# Altium project MB1814.PrjPcb (part 1 of 2)
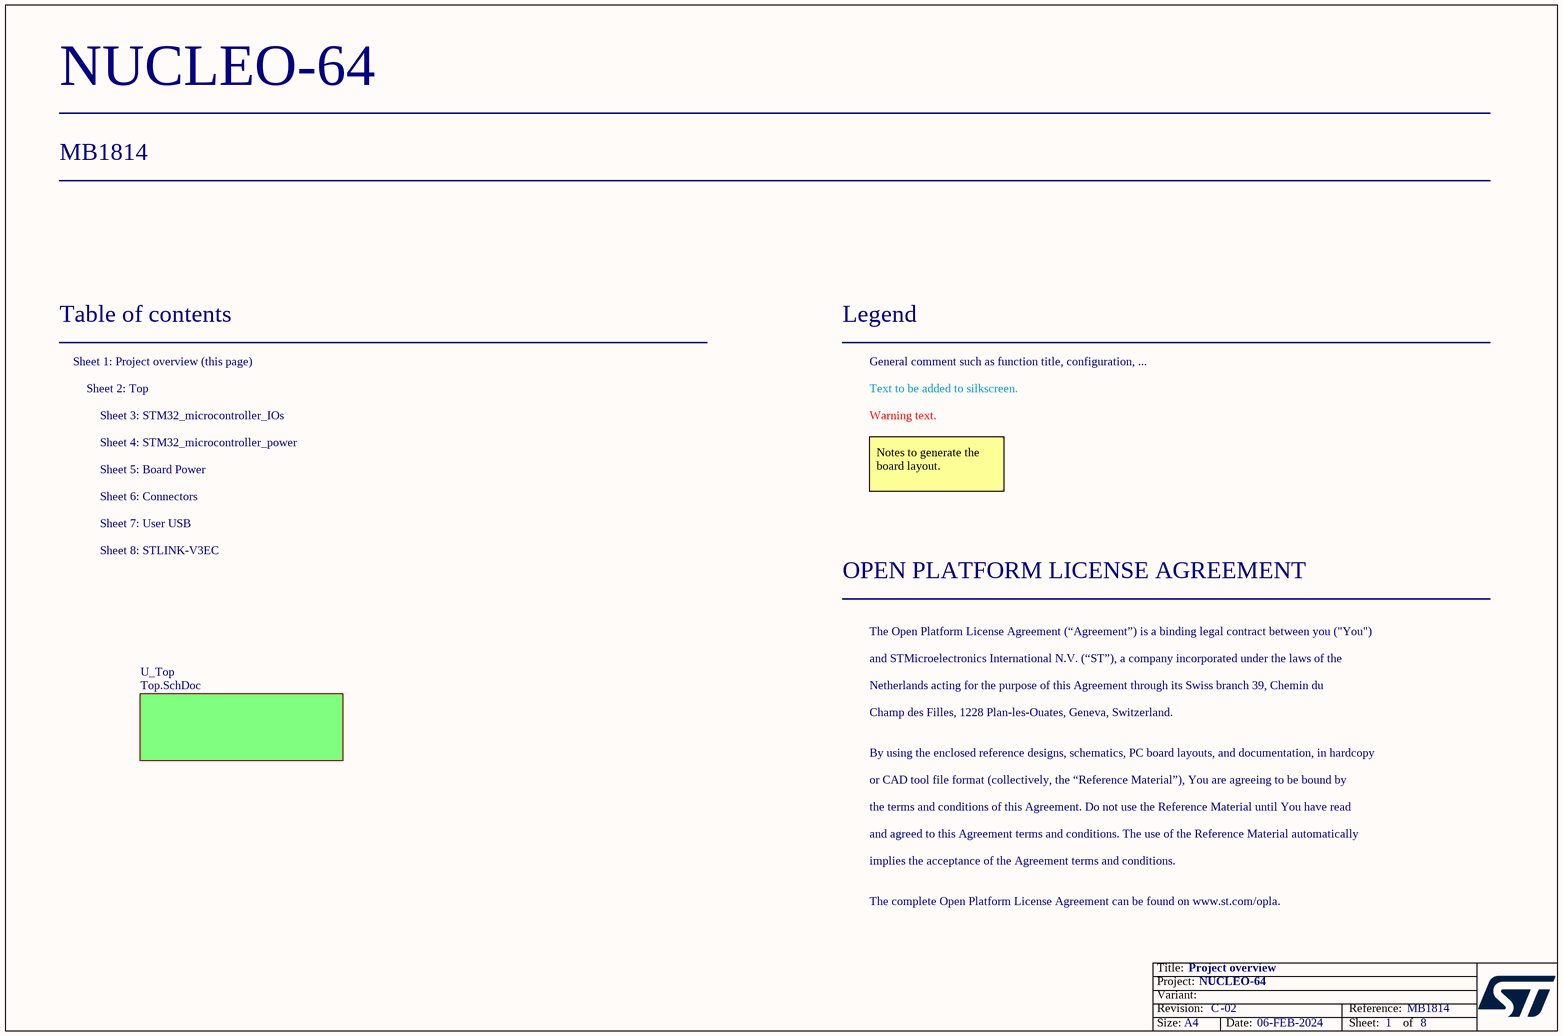
[diagram p0: Project_overview.SchDoc]
Board_Assembly_Revision: 02; Board_Document_Date: 06-FEB-2024; Board_Name: NUCLEO-64; Board_PCB_Revision: C; Board_Reference: MB1814
8 sheets, 206 parts. Net scope: flat (ports and power ports of the same name join across sheets).
Board file: MB1814.PcbDoc
Sheets:
  Project_overview.SchDoc
    U_Top = Top.SchDoc
      U_STM32_microcontroller_IOs = STM32_microcontroller_IOs.SchDoc
      U_STM32_microcontroller_power = STM32_microcontroller_power.SchDoc
      U_Board_Power = Board_Power.SchDoc
      U_User_USB = User_USB.SchDoc
      U_Connectors = Connectors.SchDoc
      U_STLINK_V3EC = STLINK_V3EC.SchDoc

## Sheet Project_overview.SchDoc: Project overview
size A4; Date: Not used; ApprovedBy: Not used; CheckedBy: Not used; Author: Not used; CompanyName: STMicroelectronics; DrawnBy: Not used; Engineer: Not used; Organization: Not used; Address1: Not used; Address2: Not used; Address3: Not used; Address4: Not used; DocumentNumber: 1; Revision: Not used; SheetNumber: 1; SheetTotal: 8; CurrentTime: Not used; CurrentDate: Not used; Time: Not used; DocumentFullPathAndName: Not used; DocumentName: Not used; ModifiedDate: Not used; ImagePath: Not used; ProjectName: Not used; Application_BuildNumber: Not used

### Sub-sheets
U_Top = Top.SchDoc: no entries

### Notes on the sheet
- Table of contents
- Sheet 1: Project overview (this page)
- Legend
- General comment such as function title, configuration, ...
- Sheet 2: Top
- Sheet 4: STM32_microcontroller_power
- Sheet 3: STM32_microcontroller_IOs
- Text to be added to silkscreen.
- Warning text.
- Sheet 5: Board Power
- Sheet 6: Connectors
- Notes to generate the board layout.
- Sheet 8: STLINK-V3EC
- Sheet 7: User USB
- OPEN PLATFORM LICENSE AGREEMENT
- The Open Platform License Agreement (“Agreement”) is a binding legal contract between you ("You")
- and STMicroelectronics International N.V. (“ST”), a company incorporated under the laws of the
- Netherlands acting for the purpose of this Agreement through its Swiss branch 39, Chemin du
- Champ des Filles, 1228 Plan-les-Ouates, Geneva, Switzerland.
- By using the enclosed reference designs, schematics, PC board layouts, and documentation, in hardcopy
- or CAD tool file format (collectively, the “Reference Material”), You are agreeing to be bound by
- the terms and conditions of this Agreement. Do not use the Reference Material until You have read
- and agreed to this Agreement terms and conditions. The use of the Reference Material automatically
- implies the acceptance of the Agreement terms and conditions.
- The complete Open Platform License Agreement can be found on www.st.com/opla.
- Title:
- Project:
- Size:
- Revision:
- Variant:
- A4
- -
- Date:
- Reference:
- Sheet:
- of

## Sheet Top.SchDoc: Top
size A4; Date: Not used; ApprovedBy: Not used; CheckedBy: Not used; Author: Not used; CompanyName: STMicroelectronics; DrawnBy: Not used; Engineer: Not used; Organization: Not used; Address1: Not used; Address2: Not used; Address3: Not used; Address4: Not used; DocumentNumber: 2; Revision: A-01-P3; SheetNumber: 2; SheetTotal: 8; CurrentTime: Not used; CurrentDate: Not used; Time: Not used; DocumentFullPathAndName: Not used; DocumentName: Not used; ModifiedDate: Not used; ImagePath: Not used; ProjectName: Not used; Application_BuildNumber: Not used
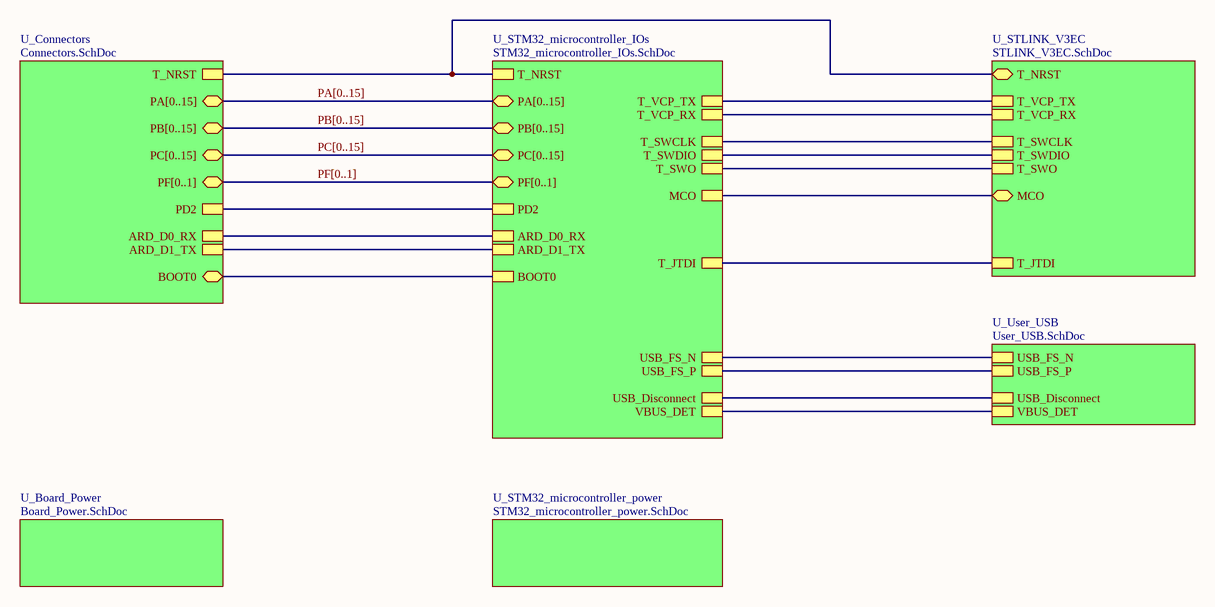
[diagram p1: Top.SchDoc]

### Sub-sheets
U_Board_Power = Board_Power.SchDoc: no entries
U_Connectors = Connectors.SchDoc: PA[0..15] (bidir), PB[0..15] (bidir), PC[0..15] (bidir), PD2, T_NRST, PF[0..1] (bidir), ARD_D0_RX, ARD_D1_TX, BOOT0 (bidir)
U_STLINK_V3EC = STLINK_V3EC.SchDoc: T_NRST (bidir), MCO (bidir), T_VCP_RX, T_VCP_TX, T_JTDI, T_SWCLK, T_SWO, T_SWDIO
U_STM32_microcontroller_IOs = STM32_microcontroller_IOs.SchDoc: PA[0..15] (bidir), PB[0..15] (bidir), PC[0..15] (bidir), PF[0..1] (bidir), ARD_D0_RX, ARD_D1_TX, MCO, PD2, T_NRST, T_VCP_TX, T_VCP_RX, T_SWCLK, T_SWO, T_SWDIO, T_JTDI, USB_FS_N, USB_FS_P, BOOT0, USB_Disconnect, VBUS_DET
U_STM32_microcontroller_power = STM32_microcontroller_power.SchDoc: no entries
U_User_USB = User_USB.SchDoc: VBUS_DET, USB_FS_N, USB_FS_P, USB_Disconnect

### Nets
(unnamed): sheet U_STM32_microcontroller_IOs/ARD_D0_RX, sheet U_Connectors/ARD_D0_RX
(unnamed): sheet U_STM32_microcontroller_IOs/ARD_D1_TX, sheet U_Connectors/ARD_D1_TX
(unnamed): sheet U_STM32_microcontroller_IOs/MCO, sheet U_STLINK_V3EC/MCO
(unnamed): sheet U_STM32_microcontroller_IOs/PD2, sheet U_Connectors/PD2
(unnamed): sheet U_STM32_microcontroller_IOs/T_NRST, sheet U_Connectors/T_NRST, sheet U_STLINK_V3EC/T_NRST
(unnamed): sheet U_STM32_microcontroller_IOs/T_VCP_TX, sheet U_STLINK_V3EC/T_VCP_TX
(unnamed): sheet U_STM32_microcontroller_IOs/T_VCP_RX, sheet U_STLINK_V3EC/T_VCP_RX
(unnamed): sheet U_STM32_microcontroller_IOs/T_SWCLK, sheet U_STLINK_V3EC/T_SWCLK
(unnamed): sheet U_STM32_microcontroller_IOs/T_SWO, sheet U_STLINK_V3EC/T_SWO
(unnamed): sheet U_STM32_microcontroller_IOs/T_SWDIO, sheet U_STLINK_V3EC/T_SWDIO
(unnamed): sheet U_STM32_microcontroller_IOs/T_JTDI, sheet U_STLINK_V3EC/T_JTDI
(unnamed): sheet U_STM32_microcontroller_IOs/USB_FS_N, sheet U_User_USB/USB_FS_N
(unnamed): sheet U_STM32_microcontroller_IOs/USB_FS_P, sheet U_User_USB/USB_FS_P
(unnamed): sheet U_STM32_microcontroller_IOs/BOOT0, sheet U_Connectors/BOOT0
(unnamed): sheet U_STM32_microcontroller_IOs/USB_Disconnect, sheet U_User_USB/USB_Disconnect
(unnamed): sheet U_STM32_microcontroller_IOs/VBUS_DET, sheet U_User_USB/VBUS_DET

### Buses and harness runs
bus PA[0..15] = sheet U_Connectors/PA[0..15] = sheet U_STM32_microcontroller_IOs/PA[0..15]
bus PB[0..15] = sheet U_Connectors/PB[0..15] = sheet U_STM32_microcontroller_IOs/PB[0..15]
bus PC[0..15] = sheet U_Connectors/PC[0..15] = sheet U_STM32_microcontroller_IOs/PC[0..15]
bus PF[0..1] = sheet U_Connectors/PF[0..1] = sheet U_STM32_microcontroller_IOs/PF[0..1]

### Notes on the sheet
- Title:
- Project:
- Size:
- Revision:
- Variant:
- A4
- -
- Date:
- Reference:
- Sheet:
- of

## Sheet STM32_microcontroller_IOs.SchDoc: STM32_microcontroller_I/Os
size A4; Date: Not used; ApprovedBy: Not used; CheckedBy: Not used; Author: Not used; CompanyName: STMicroelectronics; DrawnBy: Not used; Engineer: Not used; Organization: Not used; Address1: Not used; Address2: Not used; Address3: Not used; Address4: Not used; DocumentNumber: 3; Revision: Not used; SheetNumber: 3; SheetTotal: 8; CurrentTime: Not used; CurrentDate: Not used; Time: Not used; DocumentFullPathAndName: Not used; DocumentName: Not used; ModifiedDate: Not used; ImagePath: Not used; ProjectName: Not used; Application_BuildNumber: Not used
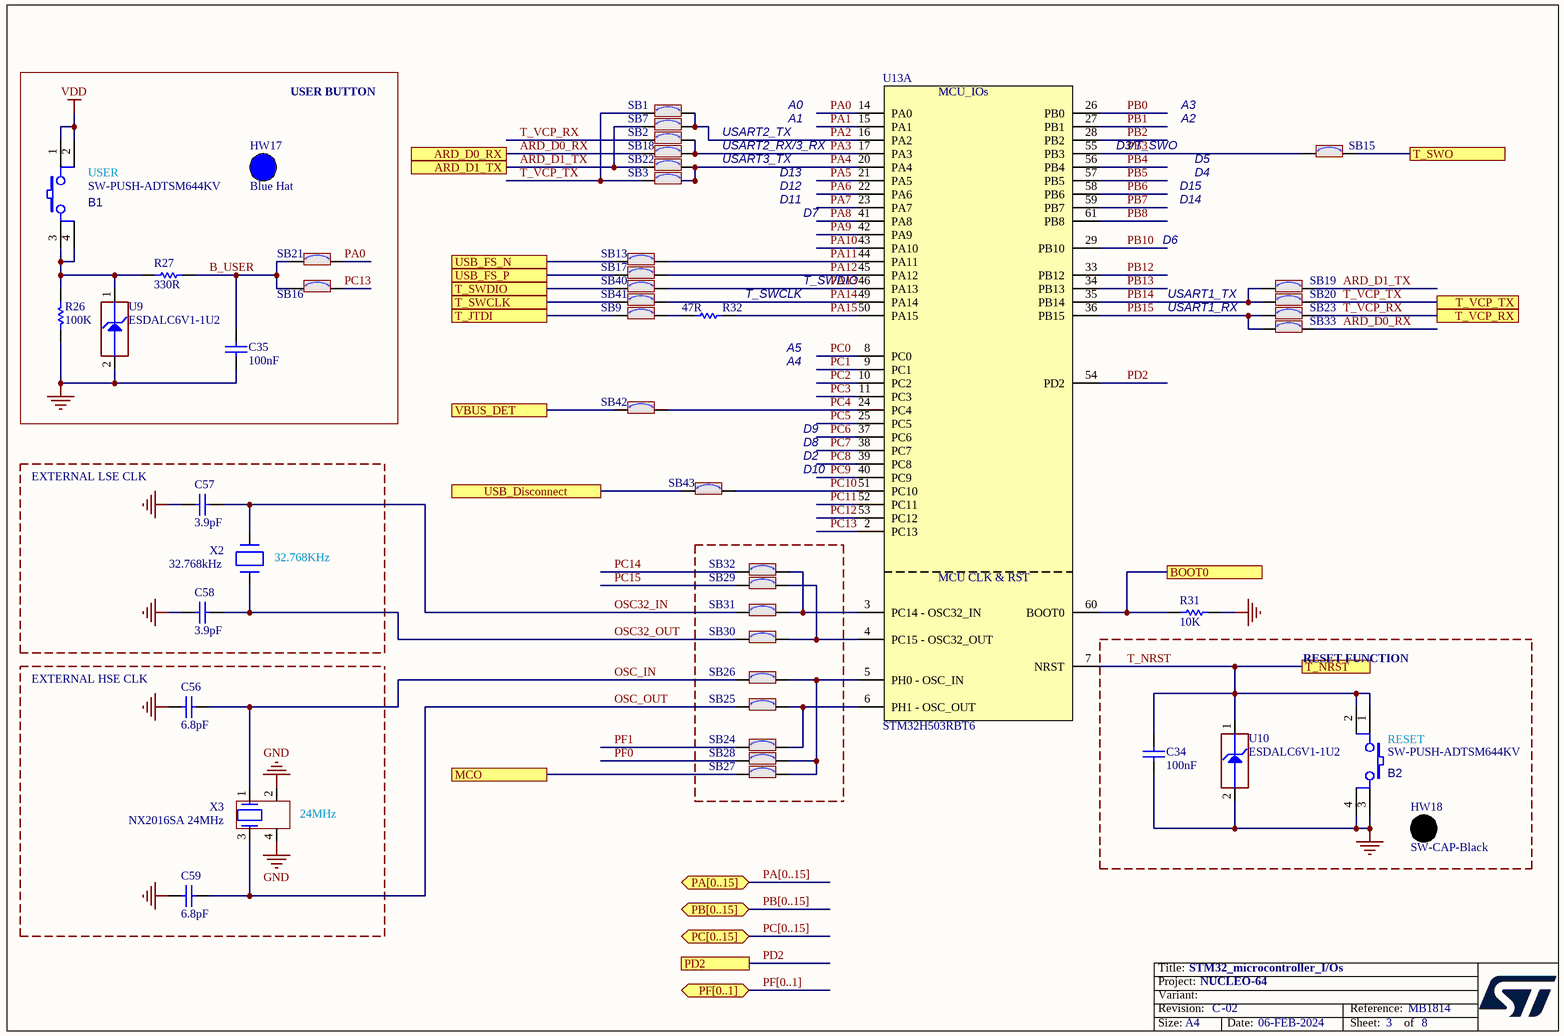
[diagram p2: STM32_microcontroller_IOs.SchDoc]

### Parts
B1  value SW-PUSH-ADTSM644KV  [SWI_APEM_ADTSM644KV_BLACK]  (hidden comment: SW_PUSH_SMD)
B2  value SW-PUSH-ADTSM644KV  [SWI_APEM_ADTSM644KV_BLACK]  (hidden comment: SW_PUSH_SMD)
C34  value 100nF  [C0402]  (hidden comment: Capacitor)
C35  value 100nF  [C0402]  (hidden comment: Capacitor)
C56  value 6.8pF  [C0402]
C57  value 3.9pF  [C0402]  (hidden comment: Capacitor)
C58  value 3.9pF  [C0402]  (hidden comment: Capacitor)
C59  value 6.8pF  [C0402]
HW17  value Blue Hat  (hidden comment: BUTTON_HAT_BLUE)  (mechanical)
HW18  SW-CAP-Black  [N/A]  (mechanical)
R26  value 100K  [R0603]
R27  value 330R  [R0603]
R31  value 10K  [R0603]
R32  value 47R  [R0402]
SB1  (no value)  [SOLDER-BRIDGE_R0603-0R]
SB2  (no value)  [SOLDER-BRIDGE_R0603-0R]
SB3  (no value)  [SOLDER-BRIDGE_R0603-0R]
SB7  (no value)  [SOLDER-BRIDGE_R0603-0R]
SB9  (no value)  [SOLDER-BRIDGE_R0603-0R]
SB13  (no value)  [SOLDER-BRIDGE_R0603-0R]
SB15  (no value)  [SOLDER-BRIDGE_R0603-0R]
SB16  (no value)  [SOLDER-BRIDGE_R0603-0R]
SB17  (no value)  [SOLDER-BRIDGE_R0603-0R]
SB18  (no value)  [SOLDER-BRIDGE_R0603-0R]
SB19  (no value)  [SOLDER-BRIDGE_R0603-0R]
SB20  (no value)  [SOLDER-BRIDGE_R0603-0R]
SB21  (no value)  [SOLDER-BRIDGE_R0603-0R]
SB22  (no value)  [SOLDER-BRIDGE_R0603-0R]
SB23  (no value)  [SOLDER-BRIDGE_R0603-0R]
SB24  (no value)  [SOLDER-BRIDGE_R0603-0R]
SB25  (no value)  [SOLDER-BRIDGE_R0603-0R]
SB26  (no value)  [SOLDER-BRIDGE_R0603-0R]
SB27  (no value)  [SOLDER-BRIDGE_R0603-0R]
SB28  (no value)  [SOLDER-BRIDGE_R0603-0R]
SB29  (no value)  [SOLDER-BRIDGE_R0603-0R]
SB30  (no value)  [SOLDER-BRIDGE_R0603-0R]
SB31  (no value)  [SOLDER-BRIDGE_R0603-0R]
SB32  (no value)  [SOLDER-BRIDGE_R0603-0R]
SB33  (no value)  [SOLDER-BRIDGE_R0603-0R]
SB40  (no value)  [SOLDER-BRIDGE_R0603-0R]
SB41  (no value)  [SOLDER-BRIDGE_R0603-0R]
SB42  (no value)  [SOLDER-BRIDGE_R0603-0R]
SB43  (no value)  [SOLDER-BRIDGE_R0603-0R]
U9  value ESDALC6V1-1U2  [ESD_ST0201]
U10  value ESDALC6V1-1U2  [ESD_ST0201]
U13  value STM32H503RBT6  [ICC_LQFP64_10X10_P050_SOCKET_YAMAICHI_IC149-064-069-B5_NM]  (hidden comment: STM32H503RBH6)  (part A of 2)
X2  value 32.768kHz  [CRY_NX1610SE_2P]  (hidden comment: XTAL_2_PINS)
X3  value NX2016SA 24MHz  [CRY_NX2016SA_4P]

### Ports
ARD_D0_RX, ARD_D1_TX, BOOT0, MCO, PA[0..15] (bidir), PB[0..15] (bidir), PC[0..15] (bidir), PD2, PF[0..1] (bidir), T_JTDI, T_NRST, T_SWCLK, T_SWDIO, T_SWO, T_VCP_RX, T_VCP_TX, USB_Disconnect, USB_FS_N, USB_FS_P, VBUS_DET

### Nets
GND: B2.3 B2.4 C34.1 C35.1 C56.1 C57.1 C58.1 C59.1 R26.1 R31.1 U9.2(GND) U10.2(GND) X3.2 X3.4
VDD: B1.1 B1.2
ARD_D0_RX: SB18.2 SB33.1 ; port ARD_D0_RX
ARD_D1_TX: SB7.2 SB19.1 SB22.2 ; port ARD_D1_TX
B_USER: C35.2 R27.2 SB16.1 SB21.1
BOOT0: R31.2 U13.60(BOOT0) ; port BOOT0
MCO: SB27.1 ; port MCO
OSC32_IN: C57.2 SB31.1 X2.2(X2)
OSC32_OUT: C58.2 SB30.1 X2.1(X1)
OSC_IN: C56.2 SB26.1 X3.1
OSC_OUT: C59.2 SB25.1 X3.3
PA0: SB21.2 U13.14(PA0)
PA1: U13.15(PA1)
PA2: SB1.1 SB7.1 U13.16(PA2)
PA3: SB2.1 SB18.1 U13.17(PA3)
PA4: SB3.1 SB22.1 U13.20(PA4)
PA5: U13.21(PA5)
PA6: U13.22(PA6)
PA7: U13.23(PA7)
PA8: U13.41(PA8)
PA9: U13.42(PA9)
PA10: U13.43(PA10)
PA11: SB13.2 U13.44(PA11)
PA12: SB17.2 U13.45(PA12)
PA13: SB40.2 U13.46(PA13)
PA14: SB41.2 U13.49(PA14)
PA15: R32.2 U13.50(PA15)
PB0: U13.26(PB0)
PB1: U13.27(PB1)
PB2: U13.28(PB2)
PB3: SB15.1 U13.55(PB3)
PB4: U13.56(PB4)
PB5: U13.57(PB5)
PB6: U13.58(PB6)
PB7: U13.59(PB7)
PB8: U13.61(PB8)
PB10: U13.29(PB10)
PB12: U13.33(PB12)
PB13: U13.34(PB13)
PB14: SB19.2 SB20.2 U13.35(PB14)
PB15: SB23.2 SB33.2 U13.36(PB15)
PC0: U13.8(PC0)
PC1: U13.9(PC1)
PC2: U13.10(PC2)
PC3: U13.11(PC3)
PC4: SB42.2 U13.24(PC4)
PC5: U13.25(PC5)
PC6: U13.37(PC6)
PC7: U13.38(PC7)
PC8: U13.39(PC8)
PC9: U13.40(PC9)
PC10: SB43.2 U13.51(PC10)
PC11: U13.52(PC11)
PC12: U13.53(PC12)
PC13: SB16.2 U13.2(PC13)
PC14: SB32.1
PC15: SB29.1
PD2: U13.54(PD2) ; port PD2
PF0: SB28.1
PF1: SB24.1
T_JTDI: SB9.1 ; port T_JTDI
T_NRST: B2.1 B2.2 C34.2 U10.1(IO1) U13.7(NRST) ; port T_NRST
T_SWCLK: SB41.1 ; port T_SWCLK
T_SWDIO: SB40.1 ; port T_SWDIO
T_SWO: SB15.2 ; port T_SWO
T_VCP_RX: SB2.2 SB23.1 ; port T_VCP_RX
T_VCP_TX: SB1.2 SB3.2 SB20.1 ; port T_VCP_TX
USB_Disconnect: SB43.1 ; port USB_Disconnect
USB_FS_N: SB13.1 ; port USB_FS_N
USB_FS_P: SB17.1 ; port USB_FS_P
VBUS_DET: SB42.1 ; port VBUS_DET
NetB1_3: B1.3 B1.4 R26.2 R27.1 U9.1(IO1)
NetR32_1: R32.1 SB9.2
NetSB24_2: SB24.2 SB25.2 U13.6(PH1_-_OSC_OUT)
NetSB26_2: SB26.2 SB27.2 SB28.2 U13.5(PH0_-_OSC_IN)
NetSB29_2: SB29.2 SB30.2 U13.4(PC15_-_OSC32_OUT)
NetSB31_2: SB31.2 SB32.2 U13.3(PC14_-_OSC32_IN)

### Buses and harness runs
bus PA[0..15] = port PA[0..15]
bus PB[0..15] = port PB[0..15]
bus PC[0..15] = port PC[0..15]
bus PF[0..1] = port PF[0..1]

### Notes on the sheet
- USER BUTTON
- A0
- A3
- (near B1) USER
- USART3_TX
- USART2_RX/3_RX
- USART2_TX
- D13
- A1
- D3/T_SWO
- A2
- D4
- D5
- D12
- D11
- D7
- D15
- D6
- D14
- (near R32) T_SWCLK
- (near R32) T_SWDIO
- USART1_RX
- USART1_TX
- A4
- A5
- D8
- D9
- EXTERNAL LSE CLK
- D2
- D10
- (near X2) 32.768KHz
- EXTERNAL HSE CLK
- RESET FUNCTION
- (near B2) RESET
- (near X3) 24MHz
- Title:
- Project:
- Size:
- Revision:
- Variant:
- -
- Date:
- Reference:
- Sheet:
- of
- (in symbol MCD-02438, part A) MCU_IOs; MCU CLK & RST

### Library data of the parts
B1 B2 = MCD-02524: Push Button, SPST-NO, 0.05A, 12V SMT, T=7.30mm, changeable caps AKTSC62x; Part_Type: Misc; Part_Preference: Recommended; Manufacturer: APEM INC; Manufacturer_Part_Number: ADTSM644SVTR; Alternate_Manufacturer: DIPTRONICS; Alternate_Manufacturer_Part_Number: DTSM644SVTR; Internal_Part_Number: MCD-02524; Status: Checked; Package: N/A; ComponentLink1URL: http://tunmcdsvn.tun.st.com/Component_Documentation_Library/Trunk/Misc/APEM_INC_ADTS_&_AKTSC_Series; Order_Code_Digikey: 679-3994-ND; Order_Code_Farnell: N/A; Order_Code_RS: N/A
C34 C35 = MCD-00006: Capacitor, MLCC, 100nF, 16V, X7R, +/-10%, 0402, T=0.5mm; Part_Preference: Recommended; Manufacturer: YAGEO; Manufacturer_Part_Number: CC0402KRX7R7BB104; Partial_Alternate_Internal_Part_Number: MCD-03299; Order_Code_RS: 9402047; Component_Country_Of_Origin: China; ShowFields: YES; ID: 2474; Internal_Part_Number: MCD-00006; Status: Released; Part_Type: Capacitor; Package: 0402; ComponentLink1URL: http://tunmcdsvn.tun.st.com/Component_Documentation_Library/Trunk/Capacitor/YAGEO_X7R_Series; Order_Code_Digikey: 311-1338-1-ND; Order_Code_Farnell: 9402047
C56 C59 = MCD-00674: Capacitor, MLCC, 6.8pF, 50V, NPO, +-0.25pF, 0402, T=0.5mm; Manufacturer_Part_Number: CC0402CRNPO9BN6R8; Manufacturer: YAGEO; Provided_By: SUBCO; Internal_Part_Number: MCD-00674; Status: Released; Part_Type: Capacitor; Package: C0402; ComponentLink1Description: Datasheet; ComponentLink1URL: http://tunmcdsvn.tun.st.com/Component_Datasheet_Library/Trunk/Capacitors/Yageo_Capacitor_NP0_16V-to-50V; ECCN_US: N/A; ECCN_EU: N/A
C57 C58 = MCD-01602: Capacitor, MLCC, 3.9pF, 50V, NPO, +/-0.1pF, 0402, T=0.5mm; Part_Preference: Recommended; Manufacturer: YAGEO; Manufacturer_Part_Number: CC0402BRNPO9BN3R9; Component_Country_Of_Origin: China; ShowFields: YES; ID: 3702; Internal_Part_Number: MCD-01602; Status: Released; Part_Type: Capacitor; Package: 0402; ComponentLink1URL: http://tunmcdsvn.tun.st.com/Component_Documentation_Library/Trunk/Capacitor/YAGEO_NP0_Series; Order_Code_Digikey: 311-1622-1-ND; Order_Code_Farnell: N/A; Order_Code_RS: N/A
HW17 = MCD-02136: Switch hat, blue, For KTSC-62B; Part_Type: Misc; Part_Preference: Recommended; Manufacturer: APEM INC; Manufacturer_Part_Number: AKTSC62B; Order_Code_RS: 378-6779; Component_Country_Of_Origin: Unknown; ShowFields: YES; ID: 4236; Internal_Part_Number: MCD-02136; Status: Checked; ComponentLink1URL: http://tunmcdsvn.tun.st.com/Component_Datasheet_Library/Trunk/Mechanical/APEM_BLUEHAT_KTSC62; Order_Code_Digikey: AKTSC62B-ND; Order_Code_Farnell: N/A
HW18 = MCD-02526: Black round cap for ADTSM644KV; Part_Type: Mechanical; Part_Preference: Recommended; Manufacturer: APEM INC; Manufacturer_Part_Number: AKTSC62K; Value: SW-CAP-AKTSC62K; Order_code_Digikey: 679-2319-ND; Order_code_Farnell: N/A; Order_code_RS: N/A; Status: Checked; ComponentLink1URL: http://tunmcdsvn.tun.st.com/Component_Documentation_Library/Trunk/Misc/APEM_INC_ADTS_&_AKTSC_Series; Internal_Part_Number: MCD-02526; Alternate_Manufacturer: N/A; Alternate_Manufacturer_Part_Number: N/A; Package: N/A
R26 = MCD-00223: Resistor,100K,0603,1%,1/10W; Manufacturer_Part_Number: RC0603FR-07100KL; Manufacturer: YAGEO; Provided_By: Subcon; Initial_Board_Reference: MB1319; Internal_Part_Number: MCD-00223; ECCN_US: n/a; ECCN_EU: n/a; ComponentLink1Description: Yageo_Resistor_RC0603-series.pdf; Status: Released; Part_Type: Resistor; Package: R0603; ComponentLink1URL: http://tunmcdsvn.tun.st.com/Component_Datasheet_Library/Trunk/Resistors/Yageo_Resistor_RC0603-series
R27 = MCD-00197: Resistor,330R,0603,1%,1/10W; Manufacturer_Part_Number: RC0603FR-07330RL; Manufacturer: YAGEO; Provided_By: Subcon; Internal_Part_Number: MCD-00197; Status: Released; ComponentLink1Description: Yageo_Resistor_RC0603-series.pdf; ECCN_US: n/a; ECCN_EU: n/a; Part_Type: Resistor; Package: R0603; ComponentLink1URL: http://tunmcdsvn.tun.st.com/Component_Datasheet_Library/Trunk/Resistors/Yageo_Resistor_RC0603-series
R31 = MCD-00220: Resistor,10K,0603,1%,1/10W; Manufacturer_Part_Number: RC0603FR-0710KL; Manufacturer: YAGEO; Provided_By: Subcon; Initial_Board_Reference: MB1319; Internal_Part_Number: MCD-00220; ECCN_US: n/a; ECCN_EU: n/a; ComponentLink1Description: Yageo_Resistor_RC0603-series.pdf; Status: Released; Part_Type: Resistor; Package: R0603; ComponentLink1URL: http://tunmcdsvn.tun.st.com/Component_Datasheet_Library/Trunk/Resistors/Yageo_Resistor_RC0603-series
R32 = MCD-00481: Resistor,47R,0402,1%,1/16W; Manufacturer_Part_Number: RC0402FR-0747RL; Manufacturer: YAGEO; Provided_By: SUBCO; ECCN_US: EAR99; ECCN_EU: NEC; Internal_Part_Number: MCD-00481; Status: Released; Part_Type: Resistor; Package: R0402; ComponentLink1Description: Datasheet; ComponentLink1URL: http://tunmcdsvn.tun.st.com/Component_Datasheet_Library/Trunk/Resistors/Yageo_Resistor_RC0402-series
SB1-SB3 SB7 SB9 SB13 SB15-SB33 SB40-SB43 = MCD-00071: Solder Bridge ON; Part_Type: Mechanical; Manufacturer_Part_Number: RC0603JR-070RL; Manufacturer: YAGEO; Provided_By: SUBCO; Internal_Part_Number: MCD-00071; ECCN_US: n/a; ECCN_EU: n/a; Status: Released; Package: SB0603; ComponentLink1Description: Datasheet; ComponentLink1URL: http://tunmcdsvn.tun.st.com/Component_Datasheet_Library/Trunk/Resistors/Yageo_Resistor_RC0603-series
U9 U10 = MCD-00170: ESD protection 6V1; Part_Type: Diode; Manufacturer: STMICROELECTRONICS; ECCN_US: EAR99; ECCN_EU: NEC; Provided_By: Subcon; Initial_Board_Reference: MB1274; Internal_Part_Number: MCD-00170; Status: Released; Manufacturer_Part_Number: ESDALC6V1-1U2; ComponentLink1Description: STM_ESD_ESDALC6V1-1U2.pdf; ComponentLink1URL: http://tunmcdsvn.tun.st.com/Component_Datasheet_Library/Trunk/Diodes/STM_ESD_ESDALC6V1-1U2
U13 = MCD-02438: MCU, Arm Cortex-M33, 250MHz, 32-bit MCU, 128KB flash, 32KB SRAM; Part_Type: IC; Part_Preference: Recommended; Manufacturer: STMICROELECTRONICS; ShowFields: YES; ID: 4544; Internal_Part_Number: MCD-02438; Status: New; Manufacturer_Part_Number: STM32H503RBT6; Package: LQFP64; ComponentLink1URL: http://tunmcdsvn.tun.st.com/Component_Documentation_Library/Trunk/IC/STMICROELECTRONICS_STM32H503RBH6; Order_Code_Digikey: N/A; Order_Code_Farnell: N/A; Order_Code_RS: N/A
X2 = MCD-02291: Crystal, 32.768kHz, 9pF, +/-20ppm, 70KR, 1.6x1mm; Part_Type: Crystal_Osc; Part_Preference: Recommended; Manufacturer: NDK; Manufacturer_Part_Number: NX1610SE-32.768KHZ-EXS00A-MU01499; Component_Country_Of_Origin: Unknown; ShowFields: YES; ID: 4391; Internal_Part_Number: MCD-02291; Status: Released; Package: 1.6x1mm; ComponentLink1URL: http://tunmcdsvn.tun.st.com/Component_Datasheet_Library/Trunk/Crystal_Osc/NDK_NX1610SE 32.768KHz EXS00A-MU01499; Order_Code_Digikey: N/A; Order_Code_Farnell: N/A; Order_Code_RS: N/A
X3 = MCD-01036: Crystal 24MHz, 6pF, +-20ppm, 80ohms max, SMD; Part_Type: Crystal_Osc; Manufacturer_Part_Number: NX2016SA 24MHz EXS00A-CS10820; Manufacturer: NDK; BMS_Part_Number: 9157045; ECCN_US: EAR99; ECCN_EU: NEC; Provided_By: SUBCO; Internal_Part_Number: MCD-01036; Status: Released; Package: (2016) 2.0 x 1.6 x 0.45 mm; ComponentLink1Description: Datasheet; ComponentLink1URL: http://tunmcdsvn.tun.st.com/Component_Datasheet_Library/Trunk/Crystal_Osc/NDK_NX2016SA 24MHz EXS00A-CS10820 (EXS10B-27366B); Order_Code_Digikey: 644-1365

## Sheet STM32_microcontroller_power.SchDoc: STM32_microcontroller_power
size A4; Date: Not used; ApprovedBy: Not used; CheckedBy: Not used; Author: Not used; CompanyName: STMicroelectronics; DrawnBy: Not used; Engineer: Not used; Organization: Not used; Address1: Not used; Address2: Not used; Address3: Not used; Address4: Not used; DocumentNumber: 4; Revision: Not used; SheetNumber: 4; SheetTotal: 8; CurrentTime: Not used; CurrentDate: Not used; Time: Not used; DocumentFullPathAndName: Not used; DocumentName: Not used; ModifiedDate: Not used; ImagePath: Not used; ProjectName: Not used; Application_BuildNumber: Not used
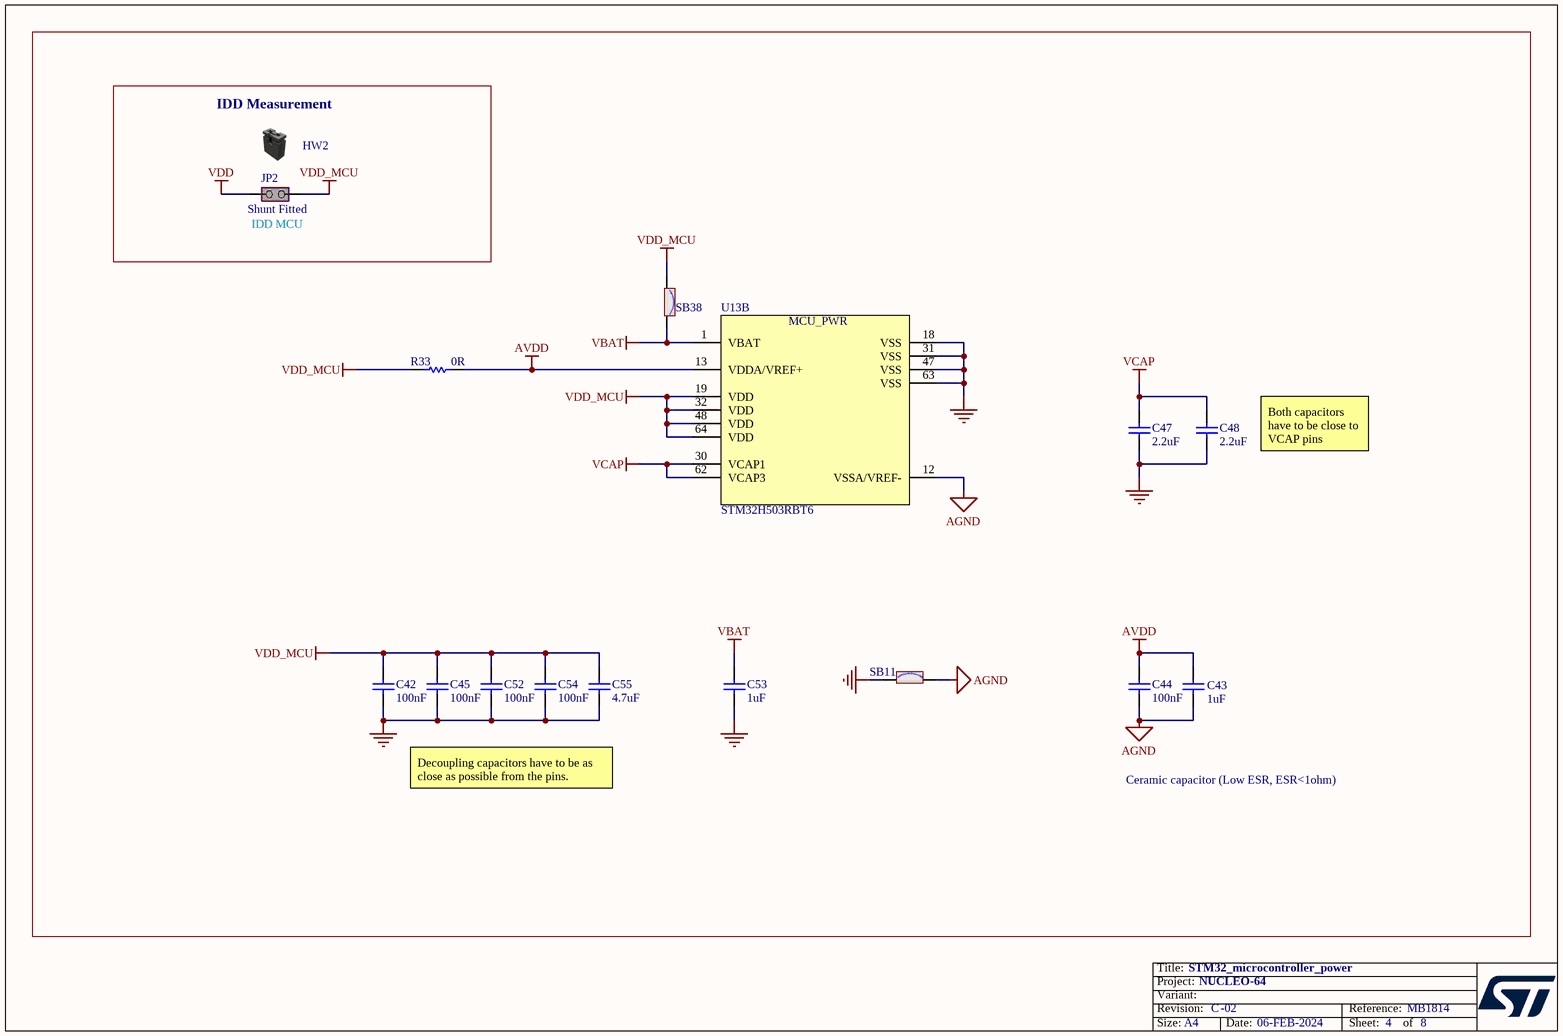
[diagram p3: STM32_microcontroller_power.SchDoc]

### Parts
C42  value 100nF  [C0402]  (hidden comment: Capacitor)
C43  value 1uF  [C0603]
C44  value 100nF  [C0402]  (hidden comment: Capacitor)
C45  value 100nF  [C0402]  (hidden comment: Capacitor)
C47  value 2.2uF  [C0603]  (hidden comment: Capacitor)
C48  value 2.2uF  [C0603]  (hidden comment: Capacitor)
C52  value 100nF  [C0402]  (hidden comment: Capacitor)
C53  value 1uF  [C0603]
C54  value 100nF  [C0402]  (hidden comment: Capacitor)
C55  value 4.7uF  [C0603]
HW2  (no value)  (mechanical)
JP2  Shunt Fitted  [CON_SAMTEC_TSW-102-07-G-S]
R33  value 0R  [R0603]  (hidden comment: Resistor)
SB11  (no value)  [SOLDER-BRIDGE_R0603-0R]
SB38  (no value)  [SOLDER-BRIDGE_R0603-0R]
U13  value STM32H503RBT6  [ICC_LQFP64_10X10_P050_SOCKET_YAMAICHI_IC149-064-069-B5_NM]  (hidden comment: STM32H503RBH6)  (part B of 2)

### Blocks framed on the sheet
IDD Measurement: HW2 JP2

### Nets
AGND: C43.1 C44.1 SB11.2 U13.12(VSSA/VREF-)
AVDD: C43.2 C44.2 R33.2 U13.13(VDDA/VREF+)
GND: C42.1 C45.1 C47.1 C48.1 C52.1 C53.1 C54.1 C55.1 SB11.1 U13.18(VSS) U13.31(VSS) U13.47(VSS) U13.63(VSS)
VBAT: C53.2 SB38.2 U13.1(VBAT)
VCAP: C47.2 C48.2 U13.30(VCAP1) U13.62(VCAP3)
VDD: JP2.1(COMMON)
VDD_MCU: C42.2 C45.2 C52.2 C54.2 C55.2 JP2.2(NO) R33.1 SB38.1 U13.19(VDD) U13.32(VDD) U13.48(VDD) U13.64(VDD)

### Notes on the sheet
- (near JP2) IDD MCU
- Both capacitors have to be close to VCAP pins
- Decoupling capacitors have to be as close as possible from the pins.
- Ceramic capacitor (Low ESR, ESR<1ohm)
- Title:
- Project:
- Size:
- Revision:
- Variant:
- A4
- -
- Date:
- Reference:
- Sheet:
- of
- (in symbol MCD-02438, part B) MCU_PWR

### Library data of the parts
C42 C44 C45 C52 C54 = MCD-00006: as C34 on sheet STM32_microcontroller_IOs; Internal_Part_Number: MCD-00006; Status: Released; Part_Type: Capacitor; Package: 0402; ComponentLink1URL: http://tunmcdsvn.tun.st.com/Component_Documentation_Library/Trunk/Capacitor/YAGEO_X7R_Series; Order_Code_Digikey: 311-1338-1-ND; Order_Code_Farnell: 9402047
C43 C53 = MCD-00010: Capacitor, MLCC, 1uF, 16V, X5R, 10%, 0603, T=0,8mm; Manufacturer_Part_Number: CC0603KRX5R7BB105; Manufacturer: YAGEO; Provided_By: Subcon; Initial_Board_Reference: MB1274; Internal_Part_Number: MCD-00010; Status: Released; Package: C0603; ComponentLink1Description: Yageo_Capacitor_X5R-series.pdf; ECCN_US: n/a; ECCN_EU: n/a; Part_Type: Capacitor; ComponentLink1URL: http://tunmcdsvn.tun.st.com/Component_Datasheet_Library/Trunk/Capacitors/Yageo_Multilayer_capacitor_X5R_series_100pF_to_100uF
C47 C48 = MCD-00012: Capacitor, MLCC, 2.2uF, 10V, X5R, +/- 10%, 0603, T=0,8mm; BMS_Part_Number: 9142010; Part_Preference: Recommended; Manufacturer: YAGEO; Manufacturer_Part_Number: CC0603KRX5R6BB225; Alternate_Manufacturer: KEMET; Alternate_Manufacturer_Part_Number: C0603C225K8PACTU; Internal_Part_Number: MCD-00012; Status: Released; Part_Type: Capacitor; Package: C0603; ComponentLink1URL: http://tunmcdsvn.tun.st.com/Component_Datasheet_Library/Trunk/Capacitors/Yageo_Multilayer_capacitor_X5R_series_100pF_to_100uF; Order_Code_Digikey: 311-1451-1-ND; Order_Code_Farnell: 2370679; Order_Code_RS: N/A
C55 = MCD-00009: Capacitor, MLCC, 4.7uF, 16V, X5R, 10%, 0603, T=0.8mm; Manufacturer_Part_Number: CC0603KRX5R7BB475; Manufacturer: YAGEO; Provided_By: subcon; Initial_Board_Reference: MB1274; Internal_Part_Number: MCD-00009; ComponentLink1Description: Yageo_Capacitor_X5R-series.pdf; ECCN_US: n/a; ECCN_EU: n/a; Status: Released; Part_Type: Capacitor; Package: C0603; ComponentLink1URL: http://tunmcdsvn.tun.st.com/Component_Datasheet_Library/Trunk/Capacitors/Yageo_Multilayer_capacitor_X5R_series_100pF_to_100uF
HW2 = MCD-00043: SHUNT 2.54mm BLACK; Manufacturer_Part_Number: SNT-100-BK-G; Manufacturer: SAMTEC; Part_Type: Mechanical; Provided_By: Subcon; Initial_Board_Reference: MB1274; Internal_Part_Number: MCD-00043; ECCN_US: n/a; ECCN_EU: n/a; ComponentLink1Description: Samtec_Shunt_Jumper_SNT100.pdf; Status: Released; ComponentLink1URL: http://tunmcdsvn.tun.st.com/Component_Datasheet_Library/Trunk/Connectors/Samtec_Shunt_Jumper_SNT100
JP2 = MCD-00683: Header, 2x1, 2,54mm, VR, TH, Height 5.84mm/2.54mm - Shunt Fitted by default; Part_Type: Connector; Manufacturer_Part_Number: TSW-102-07-x-S; Manufacturer: SAMTEC; Provided_By: Subcon; Initial_Board_Reference: MB1331; Internal_Part_Number: MCD-00683; Value: Shunt Fitted; Status: Released; ComponentLink1Description: Samtec_connector_TSW-HTSW-series.pdf; ComponentLink1URL: http://tunmcdsvn.tun.st.com/Component_Datasheet_Library/Trunk/Connectors/Samtec_TSW-HTSW-series; ECCN_US: n/a; ECCN_EU: n/a
R33 = MCD-00056: Resistor, 0R, 0603, +/-5%, 1/10W; Part_Preference: Recommended; Manufacturer: YAGEO; Manufacturer_Part_Number: RC0603JR-070RL; Internal_Part_Number: MCD-00056; Status: Released; Part_Type: Resistor; Alternate_Manufacturer: N/A; Alternate_Manufacturer_Part_Number: N/A; Package: 0603; ComponentLink1URL: http://tunmcdsvn.tun.st.com/Component_Documentation_Library/Trunk/Resistor/YAGEO_RC_L_Series; Order_Code_Digikey: 311-0.0GRCT-ND; Order_Code_Farnell: 9233130RL; Order_Code_RS: N/A
SB11 SB38 = MCD-00071: as SB1 on sheet STM32_microcontroller_IOs; Internal_Part_Number: MCD-00071; ECCN_US: n/a; ECCN_EU: n/a; Status: Released; Package: SB0603; ComponentLink1Description: Datasheet; ComponentLink1URL: http://tunmcdsvn.tun.st.com/Component_Datasheet_Library/Trunk/Resistors/Yageo_Resistor_RC0603-series
U13 = MCD-02438: as U13 on sheet STM32_microcontroller_IOs; Internal_Part_Number: MCD-02438; Status: New; Manufacturer_Part_Number: STM32H503RBT6; Package: LQFP64; ComponentLink1URL: http://tunmcdsvn.tun.st.com/Component_Documentation_Library/Trunk/IC/STMICROELECTRONICS_STM32H503RBH6; Order_Code_Digikey: N/A; Order_Code_Farnell: N/A; Order_Code_RS: N/A

## Sheet Board_Power.SchDoc: Board power
size A4; Date: Not used; ApprovedBy: Not used; CheckedBy: Not used; Author: Not used; CompanyName: STMicroelectronics; DrawnBy: Not used; Engineer: Not used; Organization: Not used; Address1: Not used; Address2: Not used; Address3: Not used; Address4: Not used; DocumentNumber: 5; Revision: Not used; SheetNumber: 5; SheetTotal: 8; CurrentTime: Not used; CurrentDate: Not used; Time: Not used; DocumentFullPathAndName: Not used; DocumentName: Not used; ModifiedDate: Not used; ImagePath: Not used; ProjectName: Not used; Application_BuildNumber: Not used
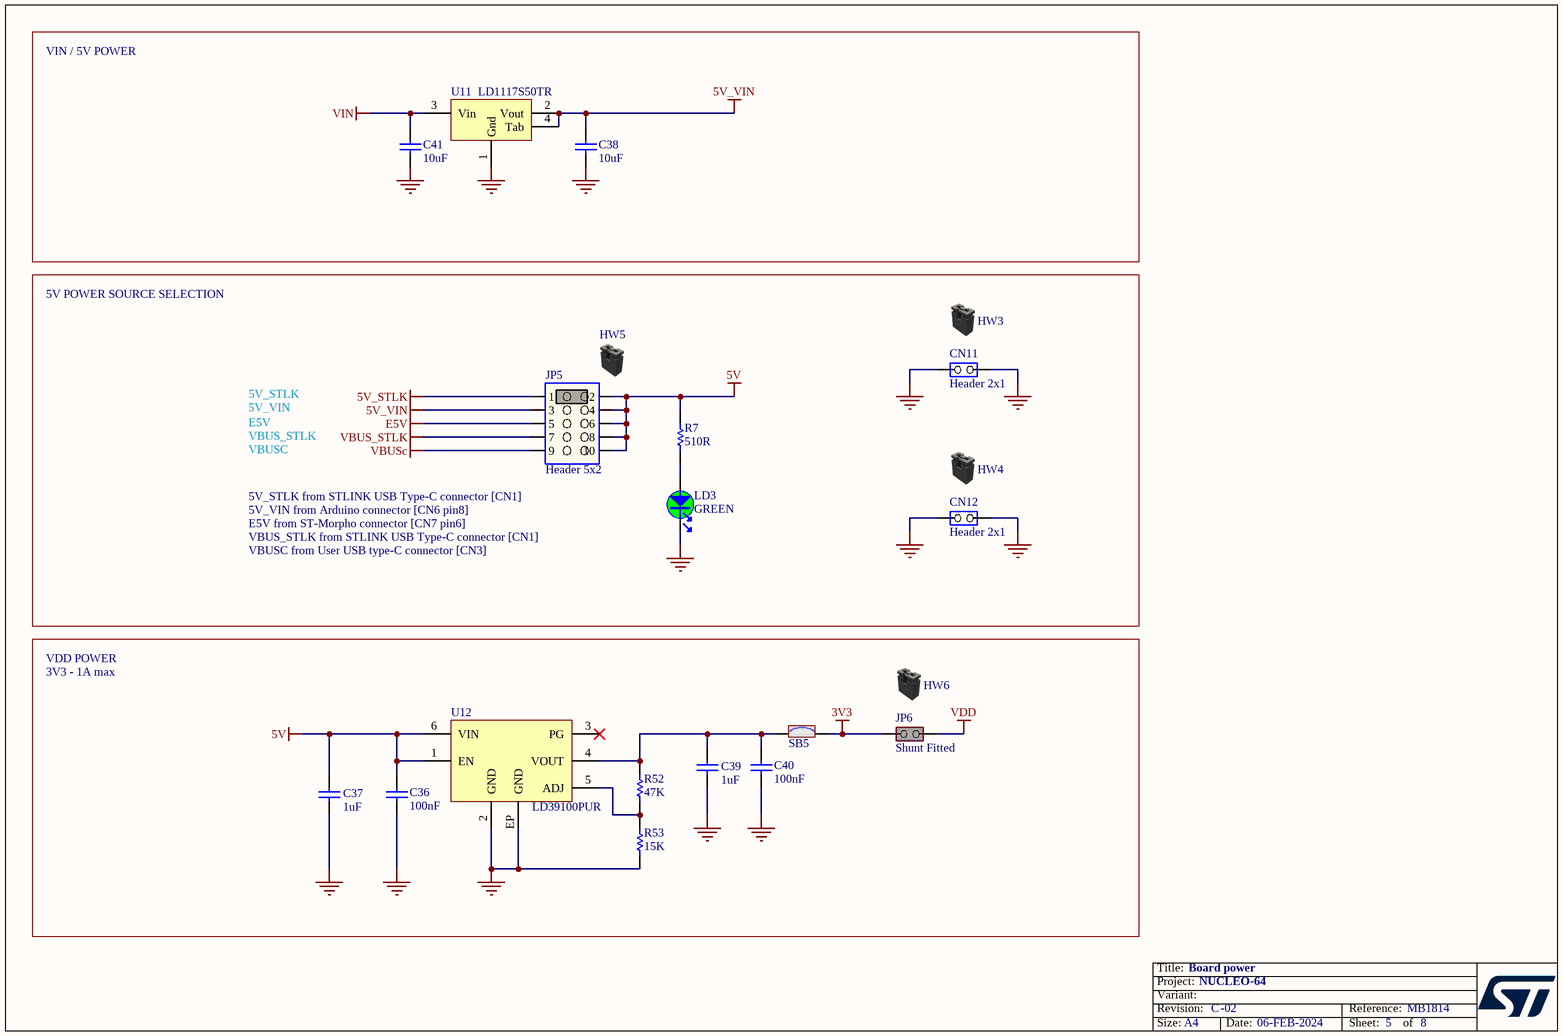
[diagram p4: Board_Power.SchDoc]

### Parts
C36  value 100nF  [C0402]  (hidden comment: Capacitor)
C37  value 1uF  [C0603]
C38  value 10uF  [C0805]
C39  value 1uF  [C0603]
C40  value 100nF  [C0402]  (hidden comment: Capacitor)
C41  value 10uF  [C0805]
CN11  value Header 2x1  [CON_SAMTEC_TSW-102-09-X-S]  (hidden comment: Jumper_Header 2x1)
CN12  value Header 2x1  [CON_SAMTEC_TSW-102-09-X-S]  (hidden comment: Jumper_Header 2x1)
HW3  (no value)  (mechanical)
HW4  (no value)  (mechanical)
HW5  (no value)  (mechanical)
HW6  (no value)  (mechanical)
JP5  value Header 5x2  [CON_SAMTEC_TSW-105-07-X-D]  (hidden comment: Jumper_Header 5x2 Fitted 1-2)
JP6  Shunt Fitted  [CON_SAMTEC_TSW-102-07-G-S]
LD3  value GREEN  [LED_0603_OSRAM_LG-Q396-PS-35_GREEN_1A2K_H0P4]  (hidden comment: LED_green)
R7  value 510R  [R0603]
R52  value 47K  [R0402]  (hidden comment: Resistor)
R53  value 15K  [R0402]  (hidden comment: Resistor)
SB5  (no value)  [SOLDER-BRIDGE_R0603-0R]
U11  value LD1117S50TR  [REG_SOT223-TAB]
U12  LD39100PUR  [ICC_DFN6-EPAD_3X3_P095]

### Blocks framed on the sheet
VIN / 5V POWER: C38 C41 U11

### Nets
3V3: JP6.1(COMMON) SB5.2
5V: C36.2 C37.2 JP5.2 JP5.4 JP5.6 JP5.8 JP5.10 R7.2 U12.1(EN) U12.6(VIN)
5V_STLK: JP5.1
5V_VIN: C38.2 JP5.3 U11.2(Vout) U11.4(Tab)
E5V: JP5.5
GND: C36.1 C37.1 C38.1 C39.1 C40.1 C41.1 CN11.1(COMMON) CN11.2(NO) CN12.1(COMMON) CN12.2(NO) LD3.2 R53.1 U11.1(Gnd) U12.2(GND) U12.EP(GND)
VBUS_STLK: JP5.7
VBUSc: JP5.9
VDD: JP6.2(NO)
VIN: C41.2 U11.3(Vin)
NetC39_2: C39.2 C40.2 R52.2 SB5.1 U12.4(VOUT)
NetLD3_1: LD3.1 R7.1
NetR52_1: R52.1 R53.2 U12.5(ADJ)

Not connected (* = marked no-connect by the designer): U12 3(PG)*

### Notes on the sheet
- 5V POWER SOURCE SELECTION
- 5V_STLK
- E5V
- 5V_VIN
- VBUS_STLK
- VBUSC
- 5V_VIN from Arduino connector [CN6 pin8]
- (near JP5) 5V_STLK from STLINK USB Type-C connector [CN1]
- E5V from ST-Morpho connector [CN7 pin6]
- VBUS_STLK from STLINK USB Type-C connector [CN1]
- VBUSC from User USB type-C connector [CN3]
- VDD POWER
- 3V3 - 1A max
- Title:
- Project:
- Size:
- Revision:
- Variant:
- A4
- -
- Date:
- Reference:
- Sheet:
- of

### Library data of the parts
C36 C40 = MCD-00006: as C34 on sheet STM32_microcontroller_IOs; Internal_Part_Number: MCD-00006; Status: Released; Part_Type: Capacitor; Package: 0402; ComponentLink1URL: http://tunmcdsvn.tun.st.com/Component_Documentation_Library/Trunk/Capacitor/YAGEO_X7R_Series; Order_Code_Digikey: 311-1338-1-ND; Order_Code_Farnell: 9402047
C37 C39 = MCD-00010: as C43 on sheet STM32_microcontroller_power; Internal_Part_Number: MCD-00010; Status: Released; Package: C0603; ComponentLink1Description: Yageo_Capacitor_X5R-series.pdf; ECCN_US: n/a; ECCN_EU: n/a; Part_Type: Capacitor; ComponentLink1URL: http://tunmcdsvn.tun.st.com/Component_Datasheet_Library/Trunk/Capacitors/Yageo_Multilayer_capacitor_X5R_series_100pF_to_100uF
C38 C41 = MCD-00014: Capacitor, MLCC, 10uF, 25V, X5R, 10%, 0805, T=0,85mm; Manufacturer_Part_Number: CC0805KRX5R8BB106; Manufacturer: YAGEO; ECCN_US: EAR99; ECCN_EU: NEC; Provided_By: SUBCO; Internal_Part_Number: MCD-00014; ComponentLink1Description: Datasheet; Status: Released; Part_Type: Capacitor; Package: C0805; ComponentLink1URL: http://tunmcdsvn.tun.st.com/Component_Datasheet_Library/Trunk/Capacitors/Yageo_Multilayer_capacitor_X5R_series_100pF_to_100uF
CN11 CN12 = MCD-00214: Header, 2x1, 2.54mm, VR, TH, T=5.84mm/10.16mm; Part_Type: Connector; Part_Preference: Recommended; Manufacturer: SAMTEC; Manufacturer_Part_Number: TSW-102-09-G-S; Alternate_Internal_Part_Number: MCD-02393; Order_Code_RS: 180-3129; Component_Country_Of_Origin: China, Costa Rica, Malaysia, United States, Vietnam; ShowFields: YES; ID: 2652; Internal_Part_Number: MCD-00214; Status: Released; ComponentLink1URL: http://tunmcdsvn.tun.st.com/Component_Documentation_Library/Trunk/Connector/SAMTEC_TSW_Series/; Order_Code_Digikey: SAM10845-ND; Order_Code_Farnell: 3663349
HW3-HW6 = MCD-00043: as HW2 on sheet STM32_microcontroller_power; Internal_Part_Number: MCD-00043; ECCN_US: n/a; ECCN_EU: n/a; ComponentLink1Description: Samtec_Shunt_Jumper_SNT100.pdf; Status: Released; ComponentLink1URL: http://tunmcdsvn.tun.st.com/Component_Datasheet_Library/Trunk/Connectors/Samtec_Shunt_Jumper_SNT100
JP5 = MCD-01203: Header, 5x2, 2.54mm, VR, TH, T=5.84mm/2.54mm; BMS_Part_Number: 9083523; Part_Type: Connector; Part_Preference: Recommended; Manufacturer: SAMTEC; Manufacturer_Part_Number: TSW-105-07-G-D; Alternate_Internal_Part_Number: MCD-02391; Order_Code_RS: 161-2267; Component_Country_Of_Origin: China, Costa Rica, Malaysia, United States, Vietnam; ShowFields: YES; ID: 3293; Internal_Part_Number: MCD-01203; Status: Released; ComponentLink1URL: http://tunmcdsvn.tun.st.com/Component_Documentation_Library/Trunk/Connector/SAMTEC_TSW_Series/; Order_Code_Digikey: SAM1028-05-ND; Order_Code_Farnell: 2578720
JP6 = MCD-00683: as JP2 on sheet STM32_microcontroller_power; Internal_Part_Number: MCD-00683; Value: Shunt Fitted; Status: Released; ComponentLink1Description: Samtec_connector_TSW-HTSW-series.pdf; ComponentLink1URL: http://tunmcdsvn.tun.st.com/Component_Datasheet_Library/Trunk/Connectors/Samtec_TSW-HTSW-series; ECCN_US: n/a; ECCN_EU: n/a
LD3 = MCD-00588: LED Green, 0603 SMD, Forward Voltage Typ=2V, Max=2.5V; Part_Type: Display; Manufacturer_Part_Number: LG Q396-PS-35; Manufacturer: OSRAM OPTO SEMICONDUCTORS; Alternate_Manufacturer_Part_Number: VLMTG1300-GS08; Alternate_Manufacturer: VISHAY SEMICONDUCTOR OPTO DIVISION; Provided_By: SUBCO; Internal_Part_Number: MCD-00588; Status: Released; Package: LED 0603; ComponentLink1Description: Datasheet; ComponentLink1URL: http://tunmcdsvn.tun.st.com/Component_Datasheet_Library/Trunk/Display/OSRAM_LED_GREEN_LG Q396-PS-35; Order_Code_Digikey: LG Q396-PS-35-ND; ECCN_US: n/a; ECCN_EU: n/a
R7 = MCD-00225: Resistor,510R,0603,1%,1/10W; Manufacturer_Part_Number: RC0603FR-07510RL; Manufacturer: YAGEO; ECCN_US: EAR99; ECCN_EU: NEC; Provided_By: SUBCO; Internal_Part_Number: MCD-00225; ComponentLink1Description: Datasheet; Status: Released; Part_Type: Resistor; Package: R0603; ComponentLink1URL: http://tunmcdsvn.tun.st.com/Component_Datasheet_Library/Trunk/Resistors/Yageo_Resistor_RC0603-series
R52 = MCD-00063: Resistor, 47K, 0402, +/-1%, 1/16W; Part_Preference: Recommended; Manufacturer: YAGEO; Manufacturer_Part_Number: RC0402FR-0747KL; Component_Country_Of_Origin: China; ShowFields: YES; ID: 2528; Internal_Part_Number: MCD-00063; Status: Released; Part_Type: Resistor; Package: 0402; ComponentLink1URL: http://tunmcdsvn.tun.st.com/Component_Documentation_Library/Trunk/Resistor/YAGEO_RC_L_Series; Order_Code_Digikey: 311-47.0KLRCT-ND; Order_Code_Farnell: 9239430; Order_Code_RS: N/A
R53 = MCD-01943: Resistor, 15K, 0402, +/-1%, 1/16W; Part_Preference: Recommended; Manufacturer: YAGEO; Manufacturer_Part_Number: RC0402FR-0715KL; Order_Code_RS: 618-6009; Component_Country_Of_Origin: China; ShowFields: YES; ID: 4043; Internal_Part_Number: MCD-01943; Status: Released; Part_Type: Resistor; Package: 0402; ComponentLink1URL: http://tunmcdsvn.tun.st.com/Component_Documentation_Library/Trunk/Resistor/YAGEO_RC_L_Series; Order_Code_Digikey: 311-15.0KLRCT-ND; Order_Code_Farnell: 2146237
SB5 = MCD-00071: as SB1 on sheet STM32_microcontroller_IOs; Internal_Part_Number: MCD-00071; ECCN_US: n/a; ECCN_EU: n/a; Status: Released; Package: SB0603; ComponentLink1Description: Datasheet; ComponentLink1URL: http://tunmcdsvn.tun.st.com/Component_Datasheet_Library/Trunk/Resistors/Yageo_Resistor_RC0603-series
U11 = MCD-00088: IC REG LDO 5V 0.8A SOT223; Manufacturer: STMICROELECTRONICS; BMS_Part_Number: 9176133; ECCN_US: EAR99; ECCN_EU: NEC; Provided_By: SUBCO with ST control; Internal_Part_Number: MCD-00088; Manufacturer_Part_Number: LD1117S50TR; ComponentLink1Description: Datasheet; Status: Released; Part_Type: IC; ComponentLink1URL: http://tunmcdsvn.tun.st.com/Component_Datasheet_Library/Trunk/IC/STM_LDO_LD1117; Package: SOT-223
U12 = MCD-03339: LDO, 1V5 to 5V5V, 1A adjustable; Part_Type: IC; Part_Preference: Recommended; Manufacturer: STMICROELECTRONICS; Component_Country_Of_Origin: Malaysia; ShowFields: YES; ID: 5455; Internal_Part_Number: MCD-03339; Value: LD39100PUR; Status: Released; Manufacturer_Part_Number: LD39100PUR; Package: DFN6 3x3mm; ComponentLink1URL: http://tunmcdsvn.tun.st.com/Component_Documentation_Library/Trunk/IC/STMICROELECTRONICS_LD39100PUR; Order_Code_Digikey: N/A; Order_Code_Farnell: N/A; Order_Code_RS: N/A

## Sheet User_USB.SchDoc: User_USB
size A4; Date: Not used; ApprovedBy: Not used; CheckedBy: Not used; Author: Not used; CompanyName: STMicroelectronics; DrawnBy: Not used; Engineer: Not used; Organization: Not used; Address1: Not used; Address2: Not used; Address3: Not used; Address4: Not used; DocumentNumber: 7; Revision: Not used; SheetNumber: 7; SheetTotal: 8; CurrentTime: Not used; CurrentDate: Not used; Time: Not used; DocumentFullPathAndName: Not used; DocumentName: Not used; ModifiedDate: Not used; ImagePath: Not used; ProjectName: Not used; Application_BuildNumber: Not used
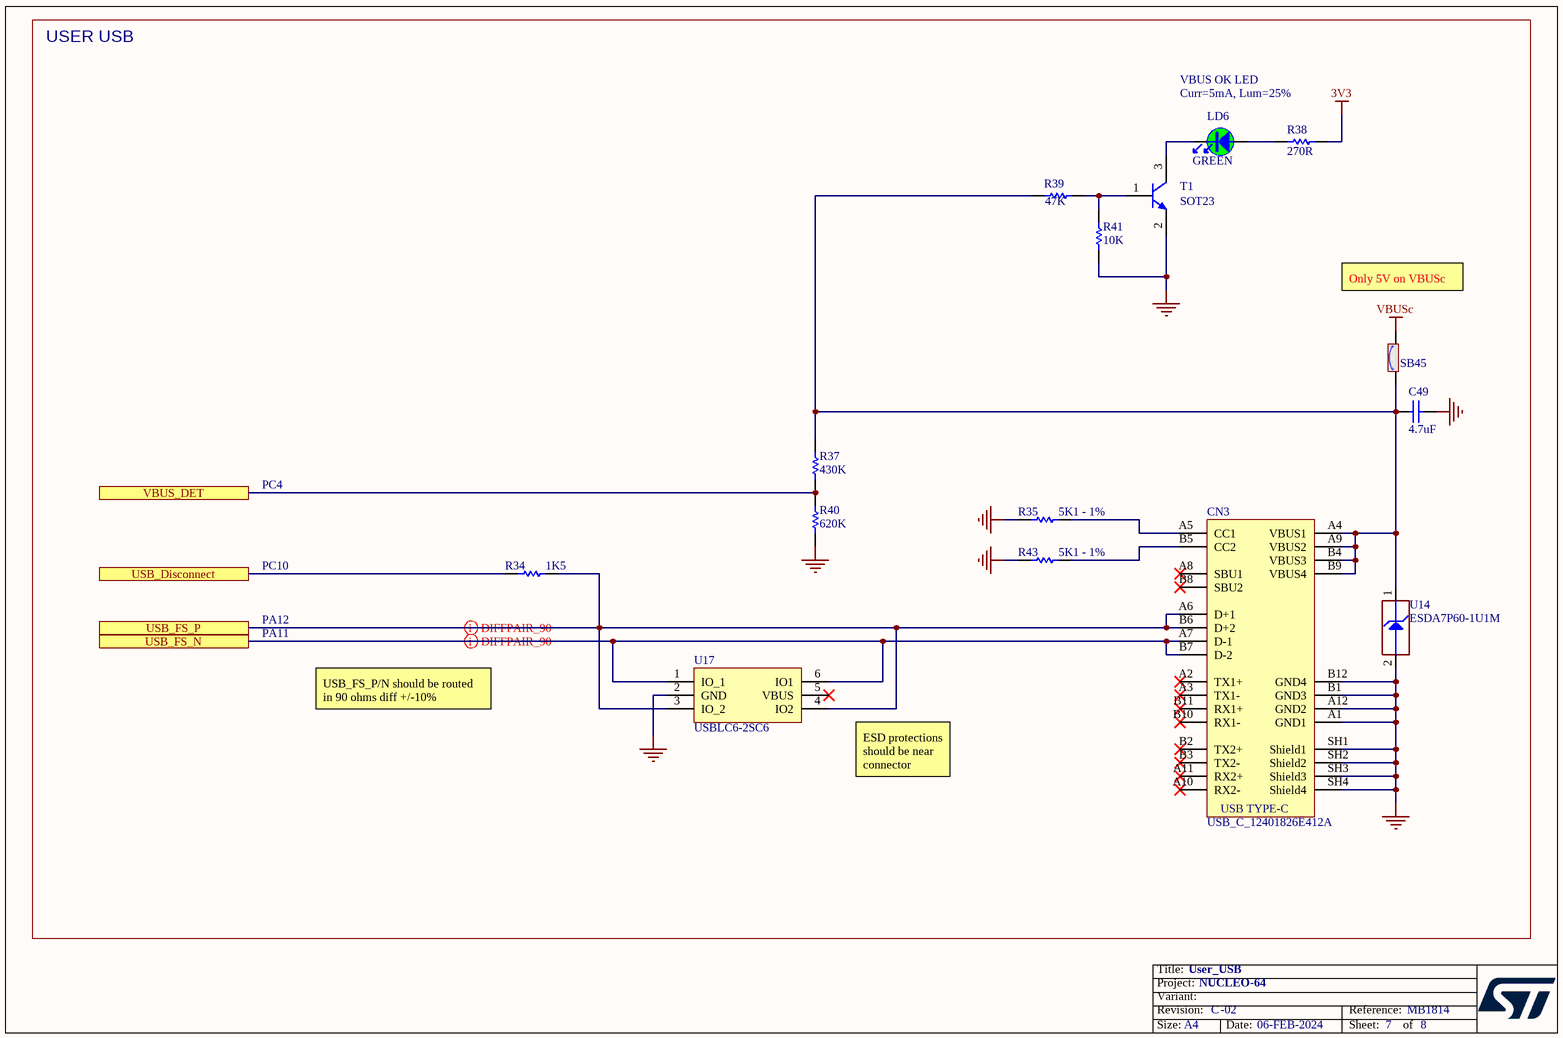
[diagram p5: User_USB.SchDoc]

### Parts
C49  value 4.7uF  [C0603]  (hidden comment: Capacitor)
CN3  value USB_C_12401826E412A  [CON_USB-TYPEC_AMPHENOL_12401826E412A]  (hidden comment: USB_TYPE_C_Receptacle)
LD6  value GREEN  [LED_0603_OSRAM_LG-Q396-PS-35_GREEN_1A2K_H0P4]  (hidden comment: LED_green)
R34  value 1K5  [R0603]  (hidden comment: Resistor)
R35  value 5K1 - 1%  [R0603]  (hidden comment: Resistor)
R37  value 430K  [R0603]  (hidden comment: Resistor)
R38  value 270R  [R0402]  (hidden comment: Resistor)
R39  value 47K  [R0402]  (hidden comment: Resistor)
R40  value 620K  [R0603]  (hidden comment: Resistor)
R41  value 10K  [R0402]  (hidden comment: Resistor)
R43  value 5K1 - 1%  [R0603]  (hidden comment: Resistor)
SB45  (no value)  [SOLDER-BRIDGE_R0603-0R]
T1  value SOT23  [NPN_SOT23]  (hidden comment: 9013-SOT23)
U14  value ESDA7P60-1U1M  [ESD_QFN2_1P6X1_P125]  (hidden comment: ESD-TRANSIL)
U17  USBLC6-2SC6  [ESD_SOT23-6L]

### Ports
USB_Disconnect, USB_FS_N, USB_FS_P, VBUS_DET

### Nets
3V3: R38.2
GND: C49.1 CN3.A1(GND1) CN3.A12(GND2) CN3.B1(GND3) CN3.B12(GND4) CN3.SH1(Shield1) CN3.SH2(Shield2) CN3.SH3(Shield3) CN3.SH4(Shield4) R35.1 R40.1 R41.1 R43.1 T1.2(E) U14.2(GND) U17.2(GND)
VBUSc: SB45.2
USB_Disconnect: R34.1 ; port USB_Disconnect
USB_FS_N: CN3.A7(D-1) CN3.B7(D-2) U17.1(IO_1) U17.6(IO1) ; port USB_FS_N
USB_FS_P: CN3.A6(D+1) CN3.B6(D+2) R34.2 U17.3(IO_2) U17.4(IO2) ; port USB_FS_P
VBUS_DET: R37.1 R40.2 ; port VBUS_DET
NetC49_2: C49.2 CN3.A4(VBUS1) CN3.A9(VBUS2) CN3.B4(VBUS3) CN3.B9(VBUS4) R37.2 R39.1 SB45.1 U14.1(IO1)
NetCN3_A5: CN3.A5(CC1) R35.2
NetCN3_B5: CN3.B5(CC2) R43.2
NetLD6_1: LD6.1 R38.1
NetLD6_2: LD6.2 T1.3(C)
NetR39_2: R39.2 R41.2 T1.1(B)

Not connected (* = marked no-connect by the designer): CN3 A2(TX1+)* A3(TX1-)* A8(SBU1)* A10(RX2-)* A11(RX2+)* B2(TX2+)* B3(TX2-)* B8(SBU2)* B10(RX1-)* B11(RX1+)*; U17 5(VBUS)*

### Layout directives
differential pair: USB_FS_N, USB_FS_P

### Notes on the sheet
- USER USB
- VBUS OK LED
- Curr=5mA, Lum=25%
- Only 5V on VBUSc
- PC4
- PC10
- PA11
- PA12
- USB_FS_P/N should be routed in 90 ohms diff +/-10%
- ESD protections should be near connector
- Title:
- Project:
- Size:
- Revision:
- Variant:
- A4
- -
- Date:
- Reference:
- Sheet:
- of
- (in symbol MCD-03232) USB TYPE-C

### Library data of the parts
C49 = MCD-00009: Capacitor, MLCC, 4.7uF, 16V, X5R, 10%, 0603, T=0.8mm; Manufacturer_Part_Number: CC0603KRX5R7BB475; Manufacturer: YAGEO; Provided_By: SUBCO; ECCN_US: EAR99; ECCN_EU: NEC; Internal_Part_Number: MCD-00009; ComponentLink1Description: Datasheet; Status: Released; Package: C0603; Part_Type: Capacitor; ComponentLink1URL: http://tunmcdsvn.tun.st.com/Component_Datasheet_Library/Trunk/Capacitors/Yageo_Multilayer_capacitor_X5R_series_100pF_to_100uF
CN3 = MCD-03232: USB_TypeC, 24 pins, RA, SMD, T=2.96mm; Part_Type: Connector; Part_Preference: Recommended; Manufacturer: AMPHENOL ICC; Manufacturer_Part_Number: 12401826E412A; Component_Country_Of_Origin: China°; ShowFields: YES; ID: 5348; Internal_Part_Number: MCD-03232; Status: Released; ComponentLink1URL: http://tunmcdsvn.tun.st.com/Component_Documentation_Library/Trunk/Connector/AMPHEMOL_ICC_12401826E412A; Order_Code_Digikey: 12401826E412ATR-ND; Order_Code_Farnell: 3727763; Order_Code_RS: N/A
LD6 = MCD-00588: as LD3 on sheet Board_Power; Internal_Part_Number: MCD-00588; Status: Released; Package: LED 0603; ComponentLink1Description: Datasheet; ComponentLink1URL: http://tunmcdsvn.tun.st.com/Component_Datasheet_Library/Trunk/Display/OSRAM_LED_GREEN_LG Q396-PS-35; Order_Code_Digikey: LG Q396-PS-35-ND; ECCN_US: n/a; ECCN_EU: n/a
R34 = MCD-00217: Resistor, 1K5, 0603, +/-1%, 1/10W; BMS_Part_Number: 9129766; Part_Preference: Recommended; Manufacturer: YAGEO; Manufacturer_Part_Number: RC0603FR-071K5L; Component_Country_Of_Origin: China; ShowFields: YES; ID: 2651; Internal_Part_Number: MCD-00217; Status: Released; Part_Type: Resistor; Package: 0603; ComponentLink1URL: http://tunmcdsvn.tun.st.com/Component_Documentation_Library/Trunk/Resistor/YAGEO_RC_L_Series; Order_Code_Digikey: 311-1.50KHRCT-ND; Order_Code_Farnell: 9238506; Order_Code_RS: N/A
R35 R43 = MCD-00334: Resistor, 5K1, 0603, +/-1%, 1/10W; Part_Preference: Recommended; Manufacturer: YAGEO; Manufacturer_Part_Number: RC0603FR-075K1L; Internal_Part_Number: MCD-00334; Status: Released; Part_Type: Resistor; Alternate_Manufacturer: N/A; Alternate_Manufacturer_Part_Number: N/A; Package: 0603; ComponentLink1URL: http://tunmcdsvn.tun.st.com/Component_Documentation_Library/Trunk/Resistor/YAGEO_RC_L_Series; Order_Code_Digikey: 311-5.10KHRCT-ND; Order_Code_Farnell: 1799348; Order_Code_RS: N/A
R37 = MCD-00480: Resistor, 430K, 0603, +/-1%, 1/10W; Part_Preference: Recommended; Manufacturer: YAGEO; Manufacturer_Part_Number: RC0603FR-07430KL; Component_Country_Of_Origin: China; ShowFields: YES; ID: 2798; Internal_Part_Number: MCD-00480; Status: Released; Part_Type: Resistor; Package: 0603; ComponentLink1URL: http://tunmcdsvn.tun.st.com/Component_Documentation_Library/Trunk/Resistor/YAGEO_RC_L_Series; Order_Code_Digikey: 311-430KHRCT-ND; Order_Code_Farnell: N/A; Order_Code_RS: N/A
R38 = MCD-00441: Resistor,270R,0402,1%,1/16W; Manufacturer_Part_Number: RC0402FR-07270RL; Manufacturer: YAGEO; Provided_By: SUBCO; ECCN_US: EAR99; ECCN_EU: NEC; Internal_Part_Number: MCD-00441; Status: Released; Part_Type: Resistor; Package: R0402; ComponentLink1Description: Datasheet; ComponentLink1URL: http://tunmcdsvn.tun.st.com/Component_Datasheet_Library/Trunk/Resistors/Yageo_Resistor_RC0402-series
R39 = MCD-00063: Resistor,47K,0402,1%,1/16W; Manufacturer_Part_Number: RC0402FR-0747KL; Manufacturer: YAGEO; Provided_By: SUBCO; ECCN_US: EAR99; ECCN_EU: NEC; Internal_Part_Number: MCD-00063; ComponentLink1Description: Datasheet; Status: Released; Part_Type: Resistor; Package: R0402; ComponentLink1URL: http://tunmcdsvn.tun.st.com/Component_Datasheet_Library/Trunk/Resistors/Yageo_Resistor_RC0402-series
R40 = MCD-00506: Resistor, 620K, 0603, +/-1%, 1/10W; Part_Preference: Recommended; Manufacturer: YAGEO; Manufacturer_Part_Number: RC0603FR-07620KL; Component_Country_Of_Origin: China; ShowFields: YES; ID: 3237; Internal_Part_Number: MCD-00506; Status: Released; Part_Type: Resistor; Package: 0603; ComponentLink1URL: http://tunmcdsvn.tun.st.com/Component_Documentation_Library/Trunk/Resistor/YAGEO_RC_L_Series; Order_Code_Digikey: 311-620KHRCT-ND; Order_Code_Farnell: N/A; Order_Code_RS: N/A
R41 = MCD-00053: Resistor,10K,0402,1%,1/16W; Manufacturer_Part_Number: RC0402FR-0710KL; Manufacturer: YAGEO; Provided_By: SUBCO; ECCN_US: EAR99; ECCN_EU: NEC; Internal_Part_Number: MCD-00053; Status: Released; ComponentLink1Description: Datasheet; Part_Type: Resistor; Package: R0402; ComponentLink1URL: http://tunmcdsvn.tun.st.com/Component_Datasheet_Library/Trunk/Resistors/Yageo_Resistor_RC0402-series
SB45 = MCD-00071: as SB1 on sheet STM32_microcontroller_IOs; Internal_Part_Number: MCD-00071; ECCN_US: n/a; ECCN_EU: n/a; Status: Released; Package: SB0603; ComponentLink1Description: Datasheet; ComponentLink1URL: http://tunmcdsvn.tun.st.com/Component_Datasheet_Library/Trunk/Resistors/Yageo_Resistor_RC0603-series
T1 = MCD-00073: NPN Bipolar Transistor; Manufacturer_Part_Number: BSR14; Manufacturer: ON SEMICONDUCTOR; Part_Type: IC; Alternate_Manufacturer_Part_Number: MMBT2222ALT1G / MMBT2222ALT3G; Provided_By: SUBCO; ECCN_US: EAR99; ECCN_EU: NEC; Revision: *; Internal_Part_Number: MCD-00073; ComponentLink1Description: Datasheet; Status: Released; ComponentLink1URL: http://tunmcdsvn.tun.st.com/Component_Datasheet_Library/Trunk/IC/NXP_Transistor_BSR14; Alternate_Manufacturer: ON SEMICONDUCTOR
U14 = MCD-00251: High power transient voltage suppressor, 7V breakdown; BMS_Part_Number: 9179042; Part_Type: Diode; Part_Preference: Recommended; Manufacturer: STMICROELECTRONICS; Manufacturer_HQ_COO: EU; Internal_Part_Number: MCD-00251; Status: Released; Manufacturer_Part_Number: ESDA7P60-1U1M; ComponentLink1URL: http://tunmcdsvn.tun.st.com/Component_Datasheet_Library/Trunk/Diodes/STM_ESD_ESDA7P60-1U1M
U17 = MCD-00163: Very low capacitance ESD protection; Part_Type: IC; Manufacturer: STMICROELECTRONICS; BMS_Part_Number: 9151075; Provided_By: SUBCO with ST control; ECCN_US: EAR99; ECCN_EU: NEC; Internal_Part_Number: MCD-00163; Value: USBLC6-2SC6; Status: Released; Manufacturer_Part_Number: USBLC6-2SC6; ComponentLink1Description: Datasheet; ComponentLink1URL: http://tunmcdsvn.tun.st.com/Component_Datasheet_Library/Trunk/Diodes/STM_ESD_USBLC6-2